# Altium schematic sheet AT90CAN128.SchDoc
size A
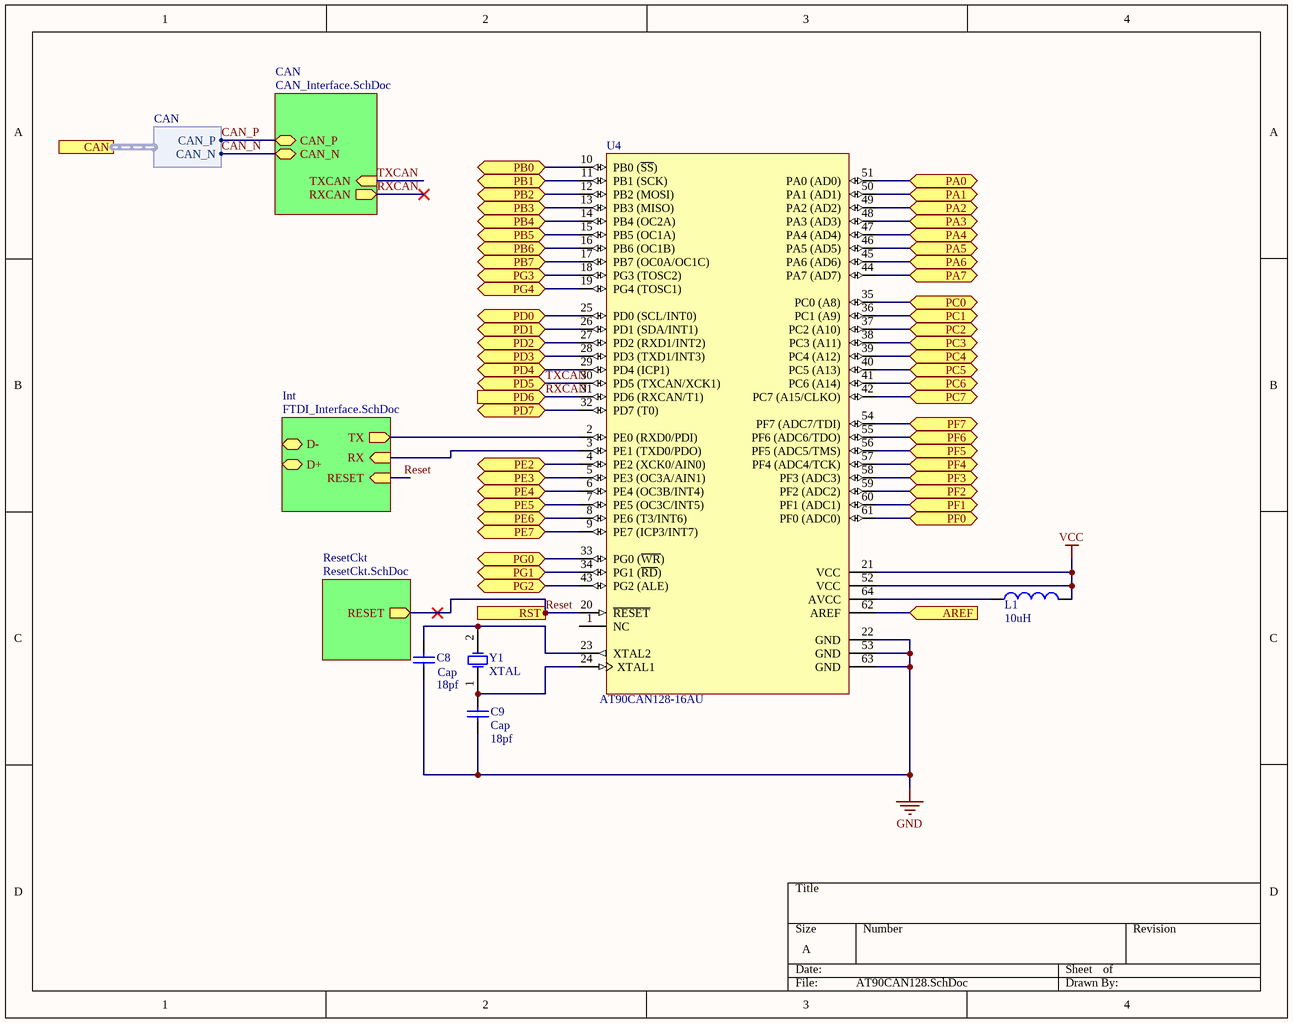
[diagram p0: AT90CAN128.SchDoc]

## Parts
C8  Cap  value 18pf  [C0805]
C9  Cap  value 18pf  [C0805]
L1  10uH  [INDC3216]
U4  AT90CAN128-16AU  [64A_M]
Y1  XTAL  [6-0805_L]

## Sub-sheets
CAN = CAN_Interface.SchDoc: CAN_P (bidir), CAN_N (bidir), TXCAN (in), RXCAN (out)
Int = FTDI_Interface.SchDoc: D- (bidir), D+ (bidir), TX (out), RX (in), RESET (in)
ResetCkt = ResetCkt.SchDoc: RESET (out)

## Ports
AREF (in), CAN (harness CAN), PA0 (bidir), PA1 (bidir), PA2 (bidir), PA3 (bidir), PA4 (bidir), PA5 (bidir), PA6 (bidir), PA7 (bidir), PB0 (bidir), PB1 (bidir), PB2 (bidir), PB3 (bidir), PB4 (bidir), PB5 (bidir), PB6 (bidir), PB7 (bidir), PC0 (bidir), PC1 (bidir), PC2 (bidir), PC3 (bidir), PC4 (bidir), PC5 (bidir), PC6 (bidir), PC7 (bidir), PD0 (bidir), PD1 (bidir), PD2 (bidir), PD3 (bidir), PD4 (bidir), PD5 (bidir), PD6 (in), PD7 (bidir), PE2 (bidir), PE3 (bidir), PE4 (bidir), PE5 (bidir), PE6 (bidir), PE7 (bidir), PF0 (bidir), PF1 (bidir), PF2 (bidir), PF3 (bidir), PF4 (bidir), PF5 (bidir), PF6 (bidir), PF7 (bidir), PG0 (bidir), PG1 (bidir), PG2 (bidir), PG3 (bidir), PG4 (bidir), RST (in)

## Harnesses
CAN: CAN_P, CAN_N

## Nets
GND: C8.1 C9.1 U4.22(GND) U4.53(GND) U4.63(GND)
VCC: L1.2 U4.21(VCC) U4.52(VCC)
AREF: U4.62(AREF) ; port AREF
CAN_N: sheet CAN/CAN_N, port CAN.CAN_N
CAN_P: sheet CAN/CAN_P, port CAN.CAN_P
PA0: U4.51(PA0_(AD0)) ; port PA0
PA1: U4.50(PA1_(AD1)) ; port PA1
PA2: U4.49(PA2_(AD2)) ; port PA2
PA3: U4.48(PA3_(AD3)) ; port PA3
PA4: U4.47(PA4_(AD4)) ; port PA4
PA5: U4.46(PA5_(AD5)) ; port PA5
PA6: U4.45(PA6_(AD6)) ; port PA6
PA7: U4.44(PA7_(AD7)) ; port PA7
PB0: U4.10(PB0_(~{SS})) ; port PB0
PB1: U4.11(PB1_(SCK)) ; port PB1
PB2: U4.12(PB2_(MOSI)) ; port PB2
PB3: U4.13(PB3_(MISO)) ; port PB3
PB4: U4.14(PB4_(OC2A)) ; port PB4
PB5: U4.15(PB5_(OC1A)) ; port PB5
PB6: U4.16(PB6_(OC1B)) ; port PB6
PB7: U4.17(PB7_(OC0A/OC1C)) ; port PB7
PC0: U4.35(PC0_(A8)) ; port PC0
PC1: U4.36(PC1_(A9)) ; port PC1
PC2: U4.37(PC2_(A10)) ; port PC2
PC3: U4.38(PC3_(A11)) ; port PC3
PC4: U4.39(PC4_(A12)) ; port PC4
PC5: U4.40(PC5_(A13)) ; port PC5
PC6: U4.41(PC6_(A14)) ; port PC6
PC7: U4.42(PC7_(A15/CLKO)) ; port PC7
PD0: U4.25(PD0_(SCL/INT0)) ; port PD0
PD1: U4.26(PD1_(SDA/INT1)) ; port PD1
PD2: U4.27(PD2_(RXD1/INT2)) ; port PD2
PD3: U4.28(PD3_(TXD1/INT3)) ; port PD3
PD4: U4.29(PD4_(ICP1)) ; port PD4
PD7: U4.32(PD7_(T0)) ; port PD7
PE2: U4.4(PE2_(XCK0/AIN0)) ; port PE2
PE3: U4.5(PE3_(OC3A/AIN1)) ; port PE3
PE4: U4.6(PE4_(OC3B/INT4)) ; port PE4
PE5: U4.7(PE5_(OC3C/INT5)) ; port PE5
PE6: U4.8(PE6_(T3/INT6)) ; port PE6
PE7: U4.9(PE7_(ICP3/INT7)) ; port PE7
PF0: U4.61(PF0_(ADC0)) ; port PF0
PF1: U4.60(PF1_(ADC1)) ; port PF1
PF2: U4.59(PF2_(ADC2)) ; port PF2
PF3: U4.58(PF3_(ADC3)) ; port PF3
PF4: U4.57(PF4_(ADC4/TCK)) ; port PF4
PF5: U4.56(PF5_(ADC5/TMS)) ; port PF5
PF6: U4.55(PF6_(ADC6/TDO)) ; port PF6
PF7: U4.54(PF7_(ADC7/TDI)) ; port PF7
PG0: U4.33(PG0_(~{WR})) ; port PG0
PG1: U4.34(PG1_(~{RD})) ; port PG1
PG2: U4.43(PG2_(ALE)) ; port PG2
PG3: U4.18(PG3_(TOSC2)) ; port PG3
PG4: U4.19(PG4_(TOSC1)) ; port PG4
Reset: U4.20(~{RESET}) ; port RST, sheet Int/RESET, sheet ResetCkt/RESET
RXCAN: U4.31(PD6_(RXCAN/T1)) ; port PD6, sheet CAN/RXCAN
TXCAN: U4.30(PD5_(TXCAN/XCK1)) ; port PD5, sheet CAN/TXCAN
NetC8_2: C8.2 U4.23(XTAL2) Y1.2(OSC2)
NetC9_2: C9.2 U4.24(XTAL1) Y1.1(OSC1)
NetL1_1: L1.1 U4.64(AVCC)
NetU4_2: U4.2(PE0_(RXD0/PDI)) ; sheet Int/TX
NetU4_3: U4.3(PE1_(TXD0/PDO)) ; sheet Int/RX

Not connected (* = marked no-connect by the designer): U4 1(NC)

## Library data of the parts
C8 C9 = Cap: Capacitor; Published: 8-Jun-2000; LatestRevisionDate: 17-Jul-2002; LatestRevisionNote: Re-released for DXP Platform.; PackageReference: RAD-0.3; Publisher: Altium Limited; PackageDescription: MLCC_0805
L1 = Inductor: Code_IEC: 1005; Published: 8-Jun-2000; LatestRevisionDate: 29-May-2009; LatestRevisionNote: IPC-7351 Footprint Added.; PackageReference: 0402-A; Publisher: Altium Limited; PackageDescription: Chip Inductor; Code_JEITA: 0402
U4 = CMP-0096-00104-2: 8-bit AVR Microcontroller, 128KB Flash and CAN Controller, 53 GPIO pins, Industrial Grade (-40° to +85°C), 64-pin LQFP, Green; PackageVersion: revC, Oct-2010; ComponentLink1Description: Manufacturer URL; ComponentLink3Description: AT90CAN32/64/128 Summary; ComponentLink2Description: AT90CAN32/64/128 Datasheet; Code_JEDEC: MS-026-AEB; DatasheetVersion: revH, Aug-2008; ComponentLink2URL: http://www.atmel.com/dyn/resources/prod_documents/doc7679.pdf; ComponentLink3URL: http://www.atmel.com/dyn/resources/prod_documents/7679S.pdf; ComponentLink1URL: http://www.atmel.com/; RevisionNote: PackageVersion updated. URLs added.; PackageReference: 64A; PackageDescription: 64-Pin Plastic Thin Profile Quad Flat Pack, 14 x 14 x 1.0 mm Body, 0.8 mm Pitch (TQFP)
Y1 = XTAL: Crystal Oscillator; Published: 8-Jun-2000; LatestRevisionDate: 17-Jul-2002; LatestRevisionNote: Re-released for DXP Platform.; PackageReference: R38; Publisher: Altium Limited; PackageDescription: Crystal, Thru-Hole; 2 Leads; Body 3.1 x 8.2 mm (Dia.xH)